# Altium schematic sheet MCU_compnts.SchDoc
size A4; SheetNumber: 3; SheetTotal: 6
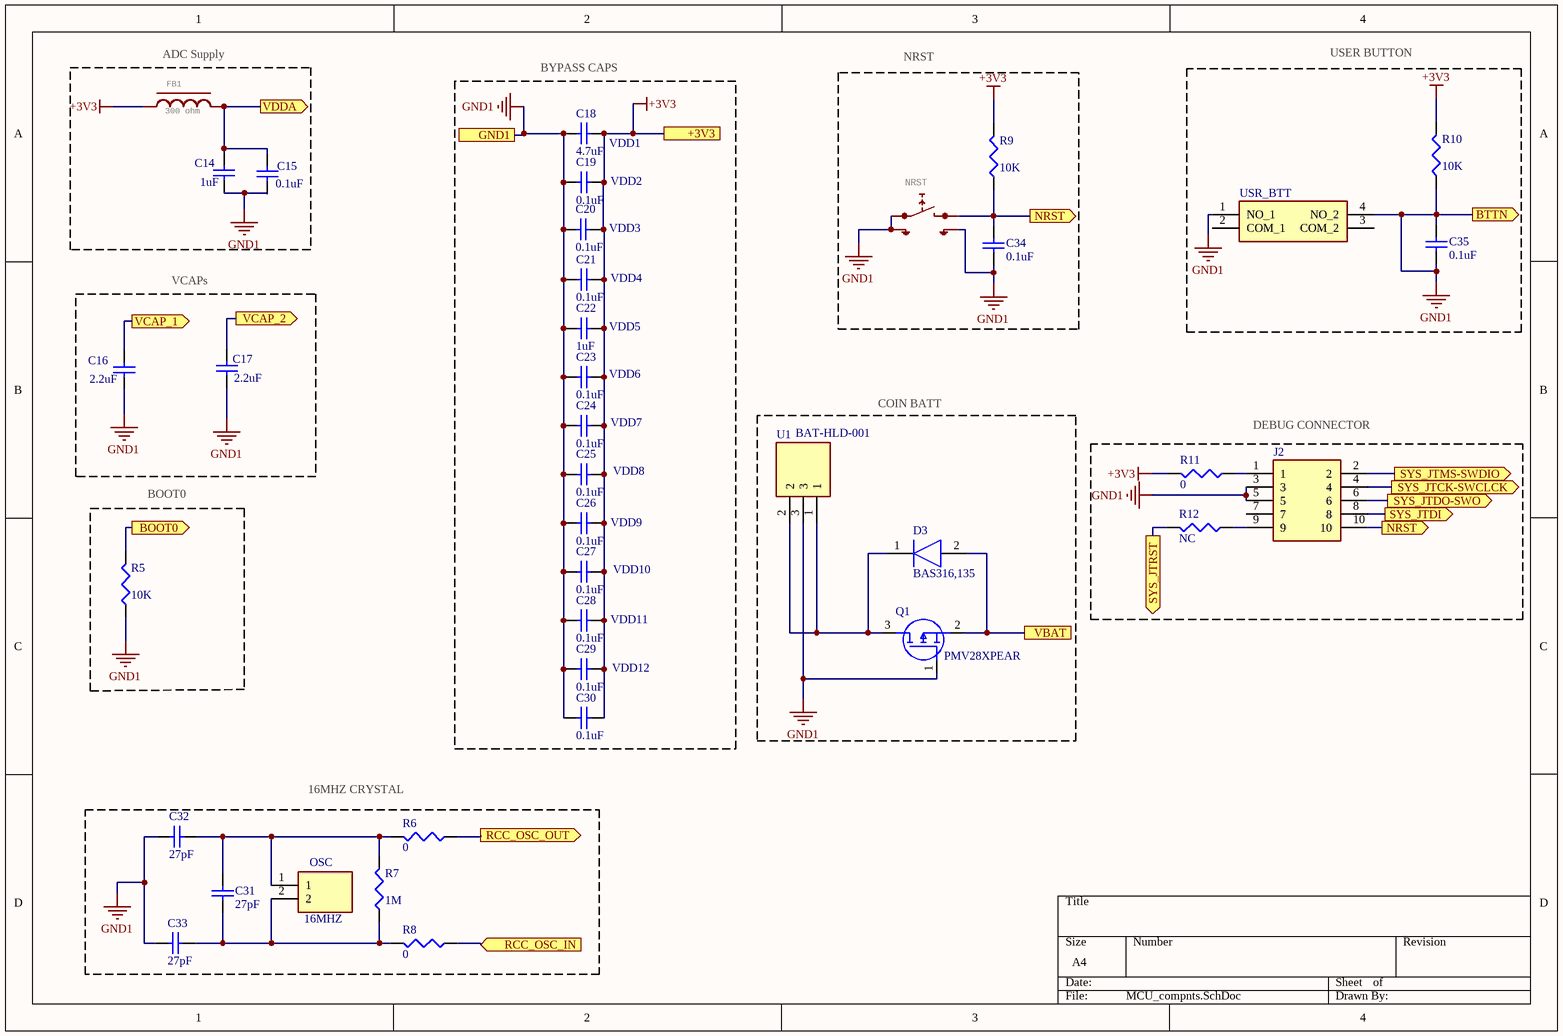
[diagram p0: MCU_compnts.SchDoc]

## Parts
C14  value 1uF  [1608[0603]]  (hidden comment: Cap Semi)
C15  value 0.1uF  [1608[0603]]  (hidden comment: Cap Semi)
C16  value 2.2uF  [1608[0603]]  (hidden comment: Cap Semi)
C17  value 2.2uF  [1608[0603]]  (hidden comment: Cap Semi)
C18  value 4.7uF  [1608[0603]]  (hidden comment: Cap Semi)
C19  value 0.1uF  [1608[0603]]  (hidden comment: Cap Semi)
C20  value 0.1uF  [1608[0603]]  (hidden comment: Cap Semi)
C21  value 0.1uF  [1608[0603]]  (hidden comment: Cap Semi)
C22  value 1uF  [1608[0603]]  (hidden comment: Cap Semi)
C23  value 0.1uF  [1608[0603]]  (hidden comment: Cap Semi)
C24  value 0.1uF  [1608[0603]]  (hidden comment: Cap Semi)
C25  value 0.1uF  [1608[0603]]  (hidden comment: Cap Semi)
C26  value 0.1uF  [1608[0603]]  (hidden comment: Cap Semi)
C27  value 0.1uF  [1608[0603]]  (hidden comment: Cap Semi)
C28  value 0.1uF  [1608[0603]]  (hidden comment: Cap Semi)
C29  value 0.1uF  [1608[0603]]  (hidden comment: Cap Semi)
C30  value 0.1uF  [1608[0603]]  (hidden comment: Cap Semi)
C31  value 27pF  [1608[0603]]  (hidden comment: Cap Semi)
C32  value 27pF  [1608[0603]]  (hidden comment: Cap Semi)
C33  value 27pF  [1608[0603]]  (hidden comment: Cap Semi)
C34  value 0.1uF  [1608[0603]]  (hidden comment: Cap Semi)
C35  value 0.1uF  [1608[0603]]  (hidden comment: Cap Semi)
D3  BAS316,135  [SOD2512X110N]
FB1  300 ohm  [0603_INCH]
J2  FTSH-105-01-L-DV-K-P-TR  [FTSH-105-XX-YYY-DV-K-P-TR]  (value not drawn)
NRST  Tactile Switches 6.1x3.7x2.5mm 100gf  [BOTON_LED_SKQYACE010]  (value not drawn)
OSC  16MHZ  [ABM3AIG16000MHZ81RT]
Q1  PMV28XPEAR  [SOT95P230X110-3N]
R5  value 10K  [J1-0603]  (hidden comment: Res3)
R6  value 0  [J1-0603]  (hidden comment: Res3)
R7  value 1M  [J1-0603]  (hidden comment: Res3)
R8  value 0  [J1-0603]  (hidden comment: Res3)
R9  value 10K  [J1-0603]  (hidden comment: Res3)
R10  value 10K  [J1-0603]  (hidden comment: Res3)
R11  value 0  [J1-0603]  (hidden comment: Res3)
R12  value NC  [J1-0603]  (hidden comment: Res3)
U1  BAT-HLD-001  [BATHLD001]
USR_BTT  KSC621GLFS  [KSC621GLFS]  (value not drawn)

## Blocks framed on the sheet
ADC Supply: C14 C15 FB1
NRST: C34 NRST R9
USER BUTTON: C35 R10 USR_BTT
VCAPs: C16 C17
COIN BATT: D3 Q1 U1
DEBUG CONNECTOR: J2 R11 R12
BOOT0: R5
16MHZ CRYSTAL: C31-C33 OSC R6-R8

## Ports
+3V3, BOOT0 (out), BTTN (out), GND1, NRST (out), RCC_OSC_IN (in), RCC_OSC_OUT (out), SYS_JTCK-SWCLCK (out), SYS_JTDI (out), SYS_JTDO-SWO (out), SYS_JTMS-SWDIO (out), SYS_JTRST (out), VBAT, VCAP_1 (out), VCAP_2 (out), VDDA (out)

## Nets
+3V3: C18.1 C19.1 C20.1 C21.1 C22.1 C23.1 C24.1 C25.1 C26.1 C27.1 C28.1 C29.1 C30.1 FB1.1 R9.2 R10.2 R11.2 ; port +3V3
GND1: C14.1 C15.1 C16.1 C17.1 C18.2 C19.2 C20.2 C21.2 C22.2 C23.2 C24.2 C25.2 C26.2 C27.2 C28.2 C29.2 C30.2 C32.1 C33.2 C34.2 C35.1 C35.2 J2.3 J2.5 NRST.1(1.1) NRST.GND1(SH) NRST.GND2(SH1) Q1.1(G) R5.1 R10.1 U1.3 USR_BTT.1(NO_1) USR_BTT.4(NO_2) ; port BTTN, port GND1
BOOT0: R5.2 ; port BOOT0
NRST: C34.1 J2.10 NRST.2(2.1) R9.1 ; port NRST
RCC_OSC_IN: R8.1 ; port RCC_OSC_IN
RCC_OSC_OUT: R6.1 ; port RCC_OSC_OUT
SYS_JTCK-SWCLCK: J2.4 ; port SYS_JTCK-SWCLCK
SYS_JTDI: J2.8 ; port SYS_JTDI
SYS_JTDO-SWO: J2.6 ; port SYS_JTDO-SWO
SYS_JTMS-SWDIO: J2.2 ; port SYS_JTMS-SWDIO
SYS_JTRST: R12.2 ; port SYS_JTRST
VBAT: D3.2(A) Q1.2(S) ; port VBAT
VCAP_1: C16.2 ; port VCAP_1
VCAP_2: C17.2 ; port VCAP_2
VDDA: C14.2 C15.2 FB1.2 ; port VDDA
NetC31_1: C31.1 C32.2 OSC.1 R6.2 R7.2
NetC31_2: C31.2 C33.1 OSC.2 R7.1 R8.2
NetD3_1: D3.1(K) Q1.3(D) U1.1 U1.2
NetJ2_1: J2.1 R11.1
NetJ2_9: J2.9 R12.1

Not connected (* = marked no-connect by the designer): J2 7; USR_BTT 2(COM_1) 3(COM_2)

## Notes on the sheet
- BYPASS CAPS
- (near C18) VDD1
- (near C20) VDD3
- (near C19) VDD2
- (near C21) VDD4
- (near C22) VDD5
- (near C23) VDD6
- (near C24) VDD7
- (near C25) VDD8
- (near C26) VDD9
- (near C27) VDD10
- (near C28) VDD11
- (near C29) VDD12

## Library data of the parts
C14-C35 = Cap Semi: Capacitor (Semiconductor SIM Model); Published: 8-Jun-2000; LatestRevisionDate: 29-May-2009; LatestRevisionNote: IPC-7351 Footprint Added.; PackageReference: C1206; Publisher: Altium Limited; PackageDescription: Chip Capacitor
D3 = BAS316,135: Diode; Manufacturer_Name: Nexperia; Datasheet Link: https://assets.nexperia.com/documents/data-sheet/BAS16_SER.pdf; Height: 1.1mm; Manufacturer_Part_Number: BAS316,135; Mouser Part Number: 771-BAS316135; Mouser Price/Stock: https://www.mouser.co.uk/ProductDetail/Nexperia/BAS316135/?qs=me8TqzrmIYU2c3xvA661vA%3D%3D; Arrow Part Number: BAS316,135; Arrow Price/Stock: https://www.arrow.com/en/products/bas316135/nexperia
FB1 = FERRITE-BEAD0603: GateName_1: G$1; SymbolName_1: FBEAD; DeviceName: 0603; LibraryName: COMPAQ; DeviceSetName: FERRITE-BEAD; Package: 0603_INCH
J2 = FTSH-105-01-L-DV-K-P-TR: Connector; Manufacturer_Name: SAMTEC; Datasheet Link: http://suddendocs.samtec.com/prints/ftsh-1xx-xx-xxx-dv-xxx-xxx-mkt.pdf; Manufacturer_Part_Number: FTSH-105-01-L-DV-K-P-TR; Mouser Part Number: 200-FTSH10501LDVKPTR; Mouser Price/Stock: https://www.mouser.co.uk/ProductDetail/Samtec/FTSH-105-01-L-DV-K-P-TR/?qs=fnpEE5GccuMUjCRgxv4voQ%3D%3D; Arrow Part Number: FTSH-105-01-L-DV-K-P-TR; Arrow Price/Stock: https://www.arrow.com/en/products/ftsh-105-01-l-dv-k-p-tr/samtec
NRST = SKQYACE010: GateName_1: G$1; SymbolName_1: BOTON_LED_SIDE_PUSHBUTTON_SHIELD; LibraryName: COMPAQ; DeviceSetName: SKQYACE010; Package: BOTON_LED_SKQYACE010
OSC = ABM3AIG-16.000MHZ-8-1R-T: Crystal or Oscillator; Manufacturer_Name: ABRACON; Datasheet Link: https://abracon.com/AIGcrystals/ABM3AIG.pdf; Height: 1.55mm; Manufacturer_Part_Number: ABM3AIG-16.000MHZ-8-1R-T; Mouser Part Number: 815-M3AIG-16-8-1RT; Mouser Price/Stock: https://www.mouser.co.uk/ProductDetail/ABRACON/ABM3AIG-16000MHZ-8-1R-T/?qs=uwxL4vQweFPcdAO4pz5jNQ%3D%3D
Q1 = PMV28XPEAR: MOSFET (P-Channel); Manufacturer_Name: Nexperia; Datasheet Link: https://componentsearchengine.com/Datasheets/2/PMV28XPEAR.pdf; Height: 1.1mm; Manufacturer_Part_Number: PMV28XPEAR; Mouser Part Number: 771-PMV28XPEAR; Mouser Price/Stock: https://www.mouser.co.uk/ProductDetail/Nexperia/PMV28XPEAR/?qs=W%2FMpXkg%252BdQ6VcRCVGMTksA%3D%3D
R5-R12 = Res3: Resistor; Published: 8-Jun-2000; LatestRevisionDate: 29-May-2009; LatestRevisionNote: IPC-7351 Footprint Added.; PackageReference: J1-0603; Publisher: Altium Limited; PackageDescription: Chip Resistor
U1 = BAT-HLD-001: Undefined or Miscellaneous; Manufacturer_Name: Linx Technologies; Datasheet Link: https://www.mouser.com/ds/2/238/bat-hld-001-220194.pdf; Height: 4mm; Manufacturer_Part_Number: BAT-HLD-001; Mouser Part Number: 712-BAT-HLD-001; Mouser Price/Stock: https://www.mouser.co.uk/ProductDetail/Linx-Technologies/BAT-HLD-001?qs=K5ta8V%252BWhta7hbVGfm4dqA%3D%3D
USR_BTT = KSC621GLFS: Switch; Manufacturer_Name: C & K COMPONENTS; Datasheet Link: https://www.ckswitches.com/media/1972/ksc6.pdf; Height: 7.7mm; Manufacturer_Part_Number: KSC621GLFS; Mouser Part Number: 611-KSC621GLFS; Mouser Price/Stock: https://www.mouser.co.uk/ProductDetail/CK/KSC621GLFS?qs=8LLMQjkBYsIEgc%252BSGMg1mA%3D%3D; Arrow Part Number: KSC621GLFS; Arrow Price/Stock: https://www.arrow.com/en/products/ksc621glfs/ck